# EAGLE schematic placa para insolar joystick (EAGLE 7.3.0)
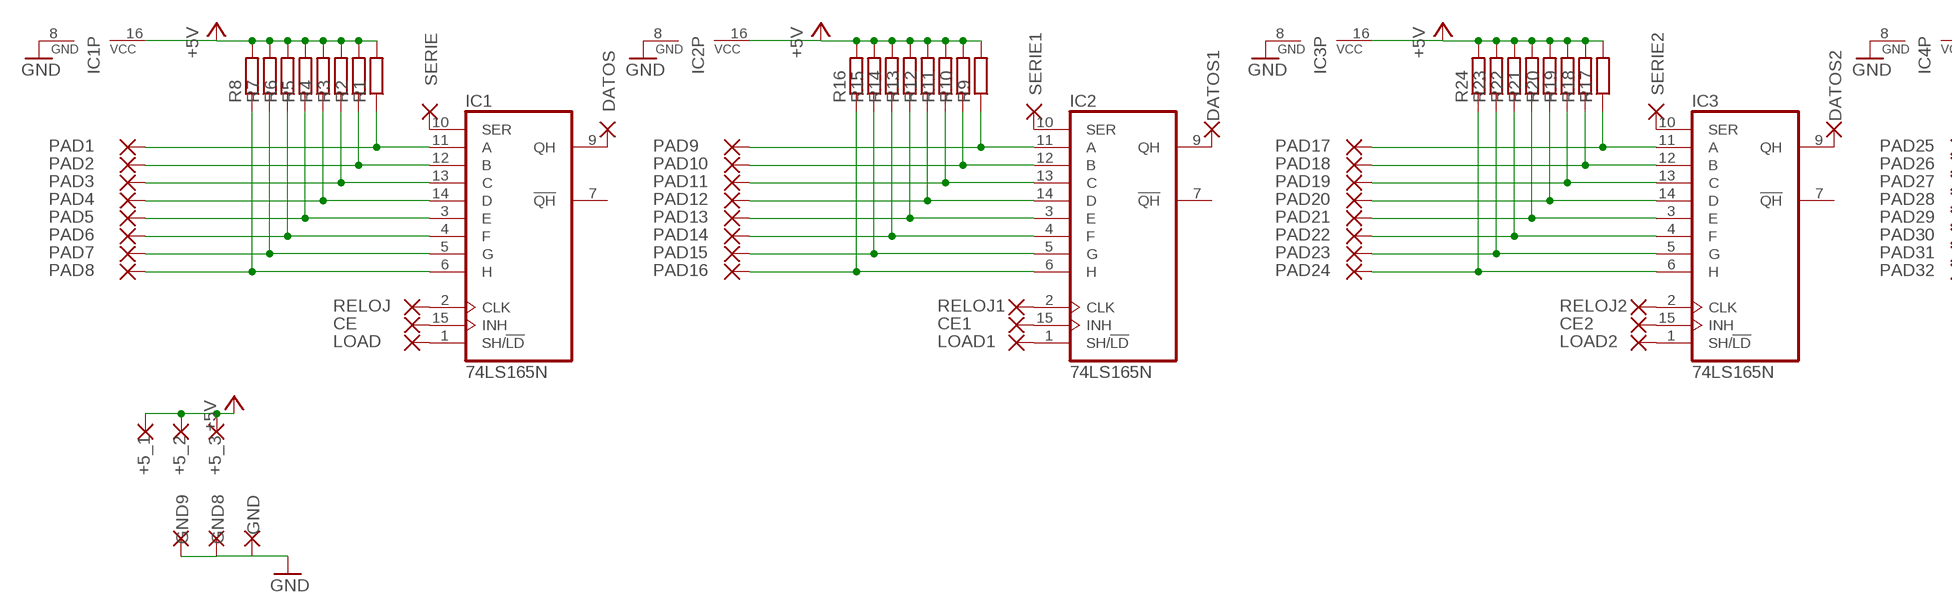
[diagram p0: schematic, sheet 1, part 1 of 2]
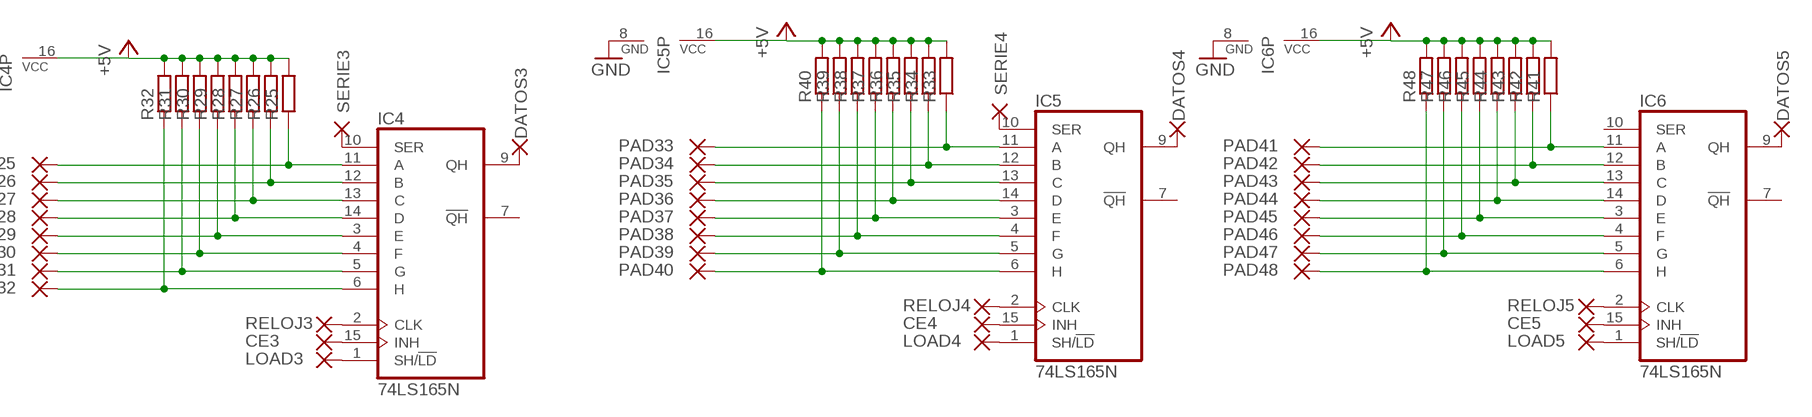
[diagram p1: schematic, sheet 1, part 2 of 2]

## Parts
+5_1  WIREPAD2,54/1,0  [2,54/1,0]
+5_2  WIREPAD2,54/1,0  [2,54/1,0]
+5_3  WIREPAD2,54/1,0  [2,54/1,0]
CE  WIREPAD2,54/1,0  [2,54/1,0]
CE1  WIREPAD2,54/1,0  [2,54/1,0]
CE2  WIREPAD2,54/1,0  [2,54/1,0]
CE3  WIREPAD2,54/1,0  [2,54/1,0]
CE4  WIREPAD2,54/1,0  [2,54/1,0]
CE5  WIREPAD2,54/1,0  [2,54/1,0]
DATOS  WIREPAD2,54/1,0  [2,54/1,0]
DATOS1  WIREPAD2,54/1,0  [2,54/1,0]
DATOS2  WIREPAD2,54/1,0  [2,54/1,0]
DATOS3  WIREPAD2,54/1,0  [2,54/1,0]
DATOS4  WIREPAD2,54/1,0  [2,54/1,0]
DATOS5  WIREPAD2,54/1,0  [2,54/1,0]
GND  WIREPAD2,54/1,0  [2,54/1,0]
GND8  WIREPAD2,54/1,0  [2,54/1,0]
GND9  WIREPAD2,54/1,0  [2,54/1,0]
IC1  74LS165N  [DIL16]
IC2  74LS165N  [DIL16]
IC3  74LS165N  [DIL16]
IC4  74LS165N  [DIL16]
IC5  74LS165N  [DIL16]
IC6  74LS165N  [DIL16]
LOAD  WIREPAD2,54/1,0  [2,54/1,0]
LOAD1  WIREPAD2,54/1,0  [2,54/1,0]
LOAD2  WIREPAD2,54/1,0  [2,54/1,0]
LOAD3  WIREPAD2,54/1,0  [2,54/1,0]
LOAD4  WIREPAD2,54/1,0  [2,54/1,0]
LOAD5  WIREPAD2,54/1,0  [2,54/1,0]
PAD1  WIREPAD2,54/1,0  [2,54/1,0]
PAD2  WIREPAD2,54/1,0  [2,54/1,0]
PAD3  WIREPAD2,54/1,0  [2,54/1,0]
PAD4  WIREPAD2,54/1,0  [2,54/1,0]
PAD5  WIREPAD2,54/1,0  [2,54/1,0]
PAD6  WIREPAD2,54/1,0  [2,54/1,0]
PAD7  WIREPAD2,54/1,0  [2,54/1,0]
PAD8  WIREPAD2,54/1,0  [2,54/1,0]
PAD9  WIREPAD2,54/1,0  [2,54/1,0]
PAD10  WIREPAD2,54/1,0  [2,54/1,0]
PAD11  WIREPAD2,54/1,0  [2,54/1,0]
PAD12  WIREPAD2,54/1,0  [2,54/1,0]
PAD13  WIREPAD2,54/1,0  [2,54/1,0]
PAD14  WIREPAD2,54/1,0  [2,54/1,0]
PAD15  WIREPAD2,54/1,0  [2,54/1,0]
PAD16  WIREPAD2,54/1,0  [2,54/1,0]
PAD17  WIREPAD2,54/1,0  [2,54/1,0]
PAD18  WIREPAD2,54/1,0  [2,54/1,0]
PAD19  WIREPAD2,54/1,0  [2,54/1,0]
PAD20  WIREPAD2,54/1,0  [2,54/1,0]
PAD21  WIREPAD2,54/1,0  [2,54/1,0]
PAD22  WIREPAD2,54/1,0  [2,54/1,0]
PAD23  WIREPAD2,54/1,0  [2,54/1,0]
PAD24  WIREPAD2,54/1,0  [2,54/1,0]
PAD25  WIREPAD2,54/1,0  [2,54/1,0]
PAD26  WIREPAD2,54/1,0  [2,54/1,0]
PAD27  WIREPAD2,54/1,0  [2,54/1,0]
PAD28  WIREPAD2,54/1,0  [2,54/1,0]
PAD29  WIREPAD2,54/1,0  [2,54/1,0]
PAD30  WIREPAD2,54/1,0  [2,54/1,0]
PAD31  WIREPAD2,54/1,0  [2,54/1,0]
PAD32  WIREPAD2,54/1,0  [2,54/1,0]
PAD33  WIREPAD2,54/1,0  [2,54/1,0]
PAD34  WIREPAD2,54/1,0  [2,54/1,0]
PAD35  WIREPAD2,54/1,0  [2,54/1,0]
PAD36  WIREPAD2,54/1,0  [2,54/1,0]
PAD37  WIREPAD2,54/1,0  [2,54/1,0]
PAD38  WIREPAD2,54/1,0  [2,54/1,0]
PAD39  WIREPAD2,54/1,0  [2,54/1,0]
PAD40  WIREPAD2,54/1,0  [2,54/1,0]
PAD41  WIREPAD2,54/1,0  [2,54/1,0]
PAD42  WIREPAD2,54/1,0  [2,54/1,0]
PAD43  WIREPAD2,54/1,0  [2,54/1,0]
PAD44  WIREPAD2,54/1,0  [2,54/1,0]
PAD45  WIREPAD2,54/1,0  [2,54/1,0]
PAD46  WIREPAD2,54/1,0  [2,54/1,0]
PAD47  WIREPAD2,54/1,0  [2,54/1,0]
PAD48  WIREPAD2,54/1,0  [2,54/1,0]
R1  R-EU_0204/7  [0204/7]
R2  R-EU_0204/7  [0204/7]
R3  R-EU_0204/7  [0204/7]
R4  R-EU_0204/7  [0204/7]
R5  R-EU_0204/7  [0204/7]
R6  R-EU_0204/7  [0204/7]
R7  R-EU_0204/7  [0204/7]
R8  R-EU_0204/7  [0204/7]
R9  R-EU_0204/7  [0204/7]
R10  R-EU_0204/7  [0204/7]
R11  R-EU_0204/7  [0204/7]
R12  R-EU_0204/7  [0204/7]
R13  R-EU_0204/7  [0204/7]
R14  R-EU_0204/7  [0204/7]
R15  R-EU_0204/7  [0204/7]
R16  R-EU_0204/7  [0204/7]
R17  R-EU_0204/7  [0204/7]
R18  R-EU_0204/7  [0204/7]
R19  R-EU_0204/7  [0204/7]
R20  R-EU_0204/7  [0204/7]
R21  R-EU_0204/7  [0204/7]
R22  R-EU_0204/7  [0204/7]
R23  R-EU_0204/7  [0204/7]
R24  R-EU_0204/7  [0204/7]
R25  R-EU_0204/7  [0204/7]
R26  R-EU_0204/7  [0204/7]
R27  R-EU_0204/7  [0204/7]
R28  R-EU_0204/7  [0204/7]
R29  R-EU_0204/7  [0204/7]
R30  R-EU_0204/7  [0204/7]
R31  R-EU_0204/7  [0204/7]
R32  R-EU_0204/7  [0204/7]
R33  R-EU_0204/7  [0204/7]
R34  R-EU_0204/7  [0204/7]
R35  R-EU_0204/7  [0204/7]
R36  R-EU_0204/7  [0204/7]
R37  R-EU_0204/7  [0204/7]
R38  R-EU_0204/7  [0204/7]
R39  R-EU_0204/7  [0204/7]
R40  R-EU_0204/7  [0204/7]
R41  R-EU_0204/7  [0204/7]
R42  R-EU_0204/7  [0204/7]
R43  R-EU_0204/7  [0204/7]
R44  R-EU_0204/7  [0204/7]
R45  R-EU_0204/7  [0204/7]
R46  R-EU_0204/7  [0204/7]
R47  R-EU_0204/7  [0204/7]
R48  R-EU_0204/7  [0204/7]
RELOJ  WIREPAD2,54/1,0  [2,54/1,0]
RELOJ1  WIREPAD2,54/1,0  [2,54/1,0]
RELOJ2  WIREPAD2,54/1,0  [2,54/1,0]
RELOJ3  WIREPAD2,54/1,0  [2,54/1,0]
RELOJ4  WIREPAD2,54/1,0  [2,54/1,0]
RELOJ5  WIREPAD2,54/1,0  [2,54/1,0]
SERIE  WIREPAD2,54/1,0  [2,54/1,0]
SERIE1  WIREPAD2,54/1,0  [2,54/1,0]
SERIE2  WIREPAD2,54/1,0  [2,54/1,0]
SERIE3  WIREPAD2,54/1,0  [2,54/1,0]
SERIE4  WIREPAD2,54/1,0  [2,54/1,0]

## Nets
+5V: +5_1.1(P) +5_2.1(P) +5_3.1(P) IC1.16(VCC) IC2.16(VCC) IC3.16(VCC) IC4.16(VCC) IC5.16(VCC) IC6.16(VCC) R1.2 R2.2 R3.2 R4.2 R5.2 R6.2 R7.2 R8.2 R9.2 R10.2 R11.2 R12.2 R13.2 R14.2 R15.2 R16.2 R17.2 R18.2 R19.2 R20.2 R21.2 R22.2 R23.2 R24.2 R25.2 R26.2 R27.2 R28.2 R29.2 R30.2 R31.2 R32.2 R33.2 R34.2 R35.2 R36.2 R37.2 R38.2 R39.2 R40.2 R41.2 R42.2 R43.2 R44.2 R45.2 R46.2 R47.2 R48.2
GND: GND8.1(P) GND9.1(P) GND.1(P) IC1.8(GND) IC2.8(GND) IC3.8(GND) IC4.8(GND) IC5.8(GND) IC6.8(GND)
N$1: IC1.11(A) PAD1.1(P) R1.1
N$2: IC1.12(B) PAD2.1(P) R2.1
N$3: IC1.13(C) PAD3.1(P) R3.1
N$4: IC1.14(D) PAD4.1(P) R4.1
N$5: IC1.3(E) PAD5.1(P) R5.1
N$6: IC1.4(F) PAD6.1(P) R6.1
N$7: IC1.5(G) PAD7.1(P) R7.1
N$8: IC1.6(H) PAD8.1(P) R8.1
N$9: IC2.11(A) PAD9.1(P) R9.1
N$10: IC2.12(B) PAD10.1(P) R10.1
N$11: IC2.13(C) PAD11.1(P) R11.1
N$12: IC2.14(D) PAD12.1(P) R12.1
N$13: IC2.3(E) PAD13.1(P) R13.1
N$14: IC2.4(F) PAD14.1(P) R14.1
N$15: IC2.5(G) PAD15.1(P) R15.1
N$16: IC2.6(H) PAD16.1(P) R16.1
N$17: IC3.11(A) PAD17.1(P) R17.1
N$18: IC3.12(B) PAD18.1(P) R18.1
N$19: IC3.13(C) PAD19.1(P) R19.1
N$20: IC3.14(D) PAD20.1(P) R20.1
N$21: IC3.3(E) PAD21.1(P) R21.1
N$22: IC3.4(F) PAD22.1(P) R22.1
N$23: IC3.5(G) PAD23.1(P) R23.1
N$24: IC3.6(H) PAD24.1(P) R24.1
N$25: IC4.11(A) PAD25.1(P) R25.1
N$26: IC4.12(B) PAD26.1(P) R26.1
N$27: IC4.13(C) PAD27.1(P) R27.1
N$28: IC4.14(D) PAD28.1(P) R28.1
N$29: IC4.3(E) PAD29.1(P) R29.1
N$30: IC4.4(F) PAD30.1(P) R30.1
N$31: IC4.5(G) PAD31.1(P) R31.1
N$32: IC4.6(H) PAD32.1(P) R32.1
N$33: IC5.11(A) PAD33.1(P) R33.1
N$34: IC5.12(B) PAD34.1(P) R34.1
N$35: IC5.13(C) PAD35.1(P) R35.1
N$36: IC5.14(D) PAD36.1(P) R36.1
N$37: IC5.3(E) PAD37.1(P) R37.1
N$38: IC5.4(F) PAD38.1(P) R38.1
N$39: IC5.5(G) PAD39.1(P) R39.1
N$40: IC5.6(H) PAD40.1(P) R40.1
N$41: IC6.11(A) PAD41.1(P) R41.1
N$42: IC6.12(B) PAD42.1(P) R42.1
N$43: IC6.13(C) PAD43.1(P) R43.1
N$44: IC6.14(D) PAD44.1(P) R44.1
N$45: IC6.3(E) PAD45.1(P) R45.1
N$46: IC6.4(F) PAD46.1(P) R46.1
N$47: IC6.5(G) PAD47.1(P) R47.1
N$48: IC6.6(H) PAD48.1(P) R48.1
N$49: IC1.2(CLK) RELOJ.1(P)
N$50: CE.1(P) IC1.15(INH)
N$51: IC1.1(SH/!LD) LOAD.1(P)
N$52: IC2.2(CLK) RELOJ1.1(P)
N$53: CE1.1(P) IC2.15(INH)
N$54: IC2.1(SH/!LD) LOAD1.1(P)
N$55: IC3.2(CLK) RELOJ2.1(P)
N$56: CE2.1(P) IC3.15(INH)
N$57: IC3.1(SH/!LD) LOAD2.1(P)
N$58: IC4.2(CLK) RELOJ3.1(P)
N$59: CE3.1(P) IC4.15(INH)
N$60: IC4.1(SH/!LD) LOAD3.1(P)
N$61: IC5.2(CLK) RELOJ4.1(P)
N$62: CE4.1(P) IC5.15(INH)
N$63: IC5.1(SH/!LD) LOAD4.1(P)
N$64: IC6.2(CLK) RELOJ5.1(P)
N$65: CE5.1(P) IC6.15(INH)
N$66: IC6.1(SH/!LD) LOAD5.1(P)
N$67: DATOS5.1(P) IC6.9(QH)
N$68: IC5.10(SER) SERIE4.1(P)
N$69: DATOS4.1(P) IC5.9(QH)
N$70: DATOS3.1(P) IC4.9(QH)
N$71: IC4.10(SER) SERIE3.1(P)
N$72: DATOS2.1(P) IC3.9(QH)
N$73: IC3.10(SER) SERIE2.1(P)
N$74: DATOS1.1(P) IC2.9(QH)
N$75: IC2.10(SER) SERIE1.1(P)
N$76: DATOS.1(P) IC1.9(QH)
N$77: IC1.10(SER) SERIE.1(P)
Unconnected: IC1.7(!QH) IC2.7(!QH) IC3.7(!QH) IC4.7(!QH) IC5.7(!QH) IC6.7(!QH) IC6.10(SER)

## Library data of the parts
+5_1-+5_3 CE CE1-CE5 DATOS DATOS1-DATOS5 GND GND8 GND9 LOAD LOAD1-LOAD5 PAD1-PAD48 RELOJ RELOJ1-RELOJ5 SERIE SERIE1-SERIE4 = wirepad:WIREPAD: Wire PAD connect wire on PCB
IC1-IC6 = 74xx-eu:74*165: 8-bit parallel load SHIFT REGISTER
R1-R48 = rcl:R-EU_: RESISTOR, European symbol